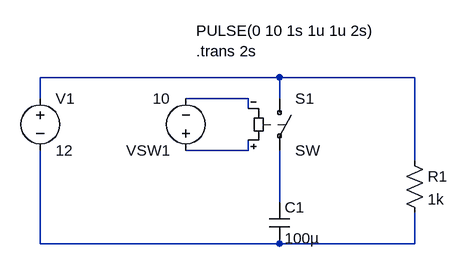
[diagram p0: schematic Draft1.asc]
Draft1.asc, the LTspice schematic file:
Version 4.1
SHEET 1 880 680
WIRE 224 -224 -144 -224
WIRE 432 -224 224 -224
WIRE -144 -192 -144 -224
WIRE 176 -192 80 -192
WIRE 224 -192 224 -224
WIRE 176 -176 176 -192
WIRE 176 -112 176 -128
WIRE 176 -112 80 -112
WIRE 432 -96 432 -224
WIRE 224 -32 224 -112
WIRE -144 32 -144 -112
WIRE 224 32 -144 32
WIRE 432 32 432 -16
WIRE 432 32 224 32
SYMBOL sw 224 -208 R0
SYMATTR InstName S1
SYMBOL voltage 80 -96 R180
WINDOW 123 0 0 Left 0
WINDOW 39 0 0 Left 0
SYMATTR InstName VSW1
SYMATTR Value 10
SYMBOL cap 208 -32 R0
SYMATTR InstName C1
SYMATTR Value 100µ
SYMBOL voltage -144 -208 R0
WINDOW 123 0 0 Left 0
WINDOW 39 0 0 Left 0
SYMATTR InstName V1
SYMATTR Value 12
SYMBOL res 416 -112 R0
SYMATTR InstName R1
SYMATTR Value 1k
TEXT 96 -296 Left 2 !PULSE(0 10 1s 1u 1u 2s)\n.trans 2s

The netlist it stands for:
* Draft1.asc
S1 N001 N004 N003 N002 SW
VSW1 N003 N002 10
C1 N004 N005 100µ
V1 N001 N005 12
R1 N001 N005 1k
PULSE(0 10 1s 1u 1u 2s)
.trans 2s
.backanno
.end